# Altium schematic sheet MainSheet.SchDoc
size A4; SheetNumber: 1; SheetTotal: 6
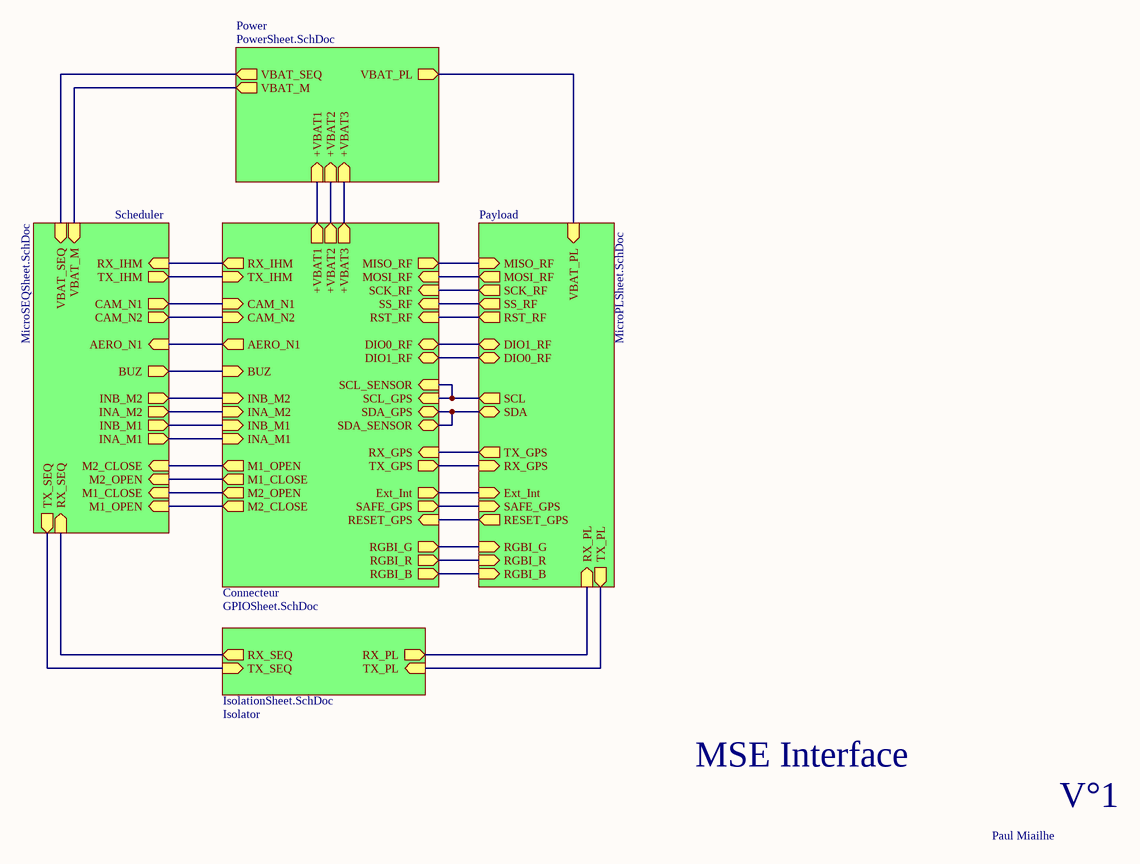
[diagram p0: MainSheet.SchDoc]

## Sub-sheets
Connecteur = GPIOSheet.SchDoc: INA_M1 (in), INB_M1 (in), INA_M2 (in), INB_M2 (in), M1_OPEN (out), M1_CLOSE (out), M2_OPEN (out), M2_CLOSE (out), BUZ (in), +VBAT1 (out), +VBAT3 (out), +VBAT2 (out), AERO_N1 (out), SS_RF (in), RX_GPS (in), Ext_Int (out), SAFE_GPS (out), RESET_GPS (in), MISO_RF (out), MOSI_RF (in), RST_RF (in), SCK_RF (in), DIO0_RF (bidir), DIO1_RF (bidir), TX_GPS (out), SDA_GPS (bidir), SCL_GPS (in), RX_IHM (out), TX_IHM (in), CAM_N1 (in), CAM_N2 (in), SDA_SENSOR (bidir), SCL_SENSOR (in), RGBI_G (out), RGBI_R (out), RGBI_B (out)
Isolator = IsolationSheet.SchDoc: RX_PL (out), TX_PL (in), RX_SEQ (out), TX_SEQ (in)
Payload = MicroPLSheet.SchDoc: SS_RF (out), RX_GPS (in), Ext_Int (in), SAFE_GPS (in), RESET_GPS (out), MISO_RF (in), MOSI_RF (out), RST_RF (out), SCK_RF (out), DIO0_RF (bidir), DIO1_RF (bidir), TX_GPS (out), SDA (bidir), SCL (out), VBAT_PL (in), RX_PL (in), TX_PL (out), RGBI_G (in), RGBI_R (in), RGBI_B (in)
Power = PowerSheet.SchDoc: VBAT_SEQ (out), +VBAT1 (in), +VBAT3 (in), VBAT_PL (out), +VBAT2 (in), VBAT_M (out)
Scheduler = MicroSEQSheet.SchDoc: M1_OPEN (in), M1_CLOSE (in), M2_OPEN (in), M2_CLOSE (in), BUZ (out), INA_M1 (out), INB_M1 (out), INA_M2 (out), INB_M2 (out), VBAT_SEQ (in), VBAT_M (in), AERO_N1 (in), RX_SEQ (in), TX_SEQ (out), CAM_N1 (out), CAM_N2 (out), RX_IHM (in), TX_IHM (out)

## Nets
(unnamed): sheet Payload/SS_RF, sheet Connecteur/SS_RF
(unnamed): sheet Payload/RX_GPS, sheet Connecteur/TX_GPS
(unnamed): sheet Payload/Ext_Int, sheet Connecteur/Ext_Int
(unnamed): sheet Payload/SAFE_GPS, sheet Connecteur/SAFE_GPS
(unnamed): sheet Payload/RESET_GPS, sheet Connecteur/RESET_GPS
(unnamed): sheet Payload/MISO_RF, sheet Connecteur/MISO_RF
(unnamed): sheet Payload/MOSI_RF, sheet Connecteur/MOSI_RF
(unnamed): sheet Payload/RST_RF, sheet Connecteur/RST_RF
(unnamed): sheet Payload/SCK_RF, sheet Connecteur/SCK_RF
(unnamed): sheet Payload/DIO0_RF, sheet Connecteur/DIO1_RF
(unnamed): sheet Payload/DIO1_RF, sheet Connecteur/DIO0_RF
(unnamed): sheet Payload/TX_GPS, sheet Connecteur/RX_GPS
(unnamed): sheet Payload/SDA, sheet Connecteur/SDA_GPS, sheet Connecteur/SDA_SENSOR
(unnamed): sheet Payload/SCL, sheet Connecteur/SCL_GPS, sheet Connecteur/SCL_SENSOR
(unnamed): sheet Payload/VBAT_PL, sheet Power/VBAT_PL
(unnamed): sheet Payload/RX_PL, sheet Isolator/RX_PL
(unnamed): sheet Payload/TX_PL, sheet Isolator/TX_PL
(unnamed): sheet Payload/RGBI_G, sheet Connecteur/RGBI_G
(unnamed): sheet Payload/RGBI_R, sheet Connecteur/RGBI_R
(unnamed): sheet Payload/RGBI_B, sheet Connecteur/RGBI_B
(unnamed): sheet Connecteur/INA_M1, sheet Scheduler/INA_M1
(unnamed): sheet Connecteur/INB_M1, sheet Scheduler/INB_M1
(unnamed): sheet Connecteur/INA_M2, sheet Scheduler/INA_M2
(unnamed): sheet Connecteur/INB_M2, sheet Scheduler/INB_M2
(unnamed): sheet Connecteur/M1_OPEN, sheet Scheduler/M2_CLOSE
(unnamed): sheet Connecteur/M1_CLOSE, sheet Scheduler/M2_OPEN
(unnamed): sheet Connecteur/M2_OPEN, sheet Scheduler/M1_CLOSE
(unnamed): sheet Connecteur/M2_CLOSE, sheet Scheduler/M1_OPEN
(unnamed): sheet Connecteur/BUZ, sheet Scheduler/BUZ
(unnamed): sheet Connecteur/+VBAT1, sheet Power/+VBAT1
(unnamed): sheet Connecteur/+VBAT3, sheet Power/+VBAT3
(unnamed): sheet Connecteur/+VBAT2, sheet Power/+VBAT2
(unnamed): sheet Connecteur/AERO_N1, sheet Scheduler/AERO_N1
(unnamed): sheet Connecteur/RX_IHM, sheet Scheduler/RX_IHM
(unnamed): sheet Connecteur/TX_IHM, sheet Scheduler/TX_IHM
(unnamed): sheet Connecteur/CAM_N1, sheet Scheduler/CAM_N1
(unnamed): sheet Connecteur/CAM_N2, sheet Scheduler/CAM_N2
(unnamed): sheet Power/VBAT_SEQ, sheet Scheduler/VBAT_SEQ
(unnamed): sheet Power/VBAT_M, sheet Scheduler/VBAT_M
(unnamed): sheet Scheduler/RX_SEQ, sheet Isolator/RX_SEQ
(unnamed): sheet Scheduler/TX_SEQ, sheet Isolator/TX_SEQ

## Notes on the sheet
- MSE Interface
- V°1
- Paul Miailhe